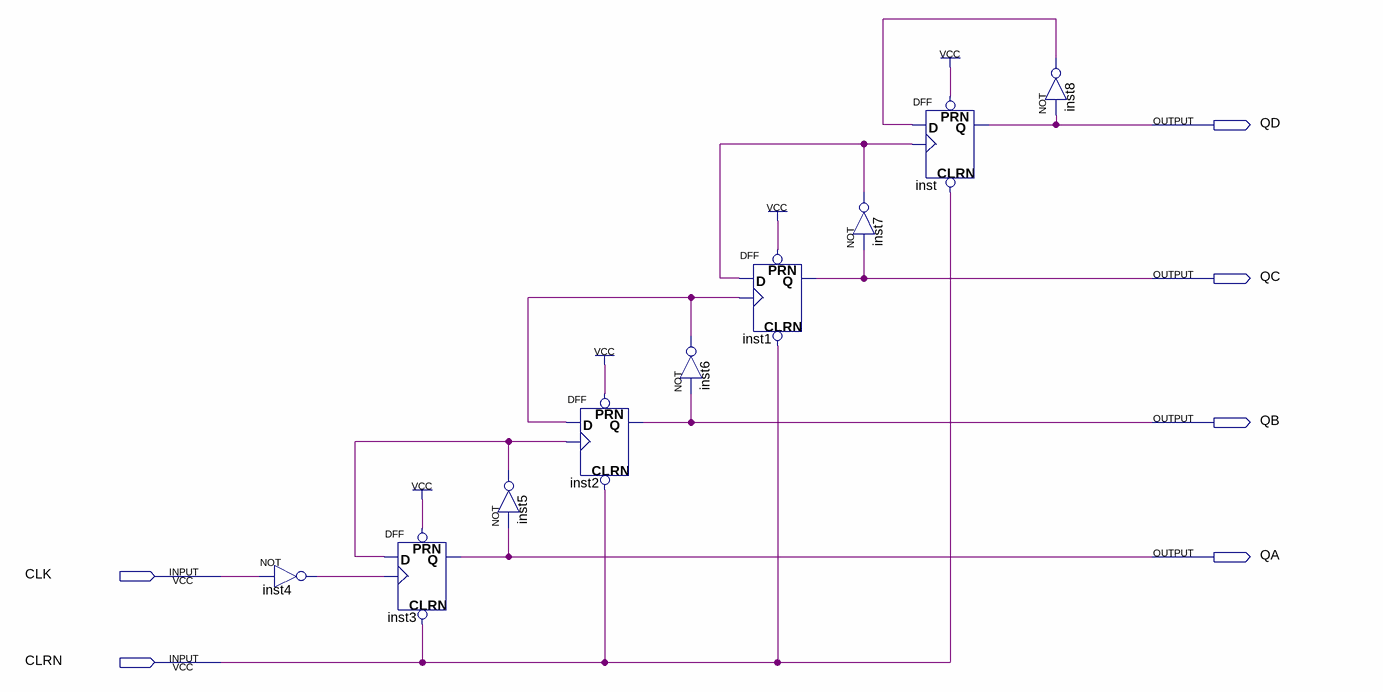
[diagram p0: schematic sheet]
// Quartus schematic FourBitUPCounter.bdf as structural Verilog: 9 symbols, 6 pins
module FourBitUPCounter (
  input  CLK,
  input  CLRN,
  output QD,
  output QC,
  output QB,
  output QA
);

  wire inst4_out, inst5_out, inst6_out, inst7_out, inst8_out;

  not inst4 (inst4_out, CLK);
  DFF inst3 (.CLRN(CLRN), .CLK(inst4_out), .D(inst5_out), .PRN(1'b1), .Q(QA));
  not inst5 (inst5_out, QA);
  DFF inst2 (.CLRN(CLRN), .CLK(inst5_out), .D(inst6_out), .PRN(1'b1), .Q(QB));
  not inst6 (inst6_out, QB);
  DFF inst1 (.CLRN(CLRN), .CLK(inst6_out), .D(inst7_out), .PRN(1'b1), .Q(QC));
  not inst7 (inst7_out, QC);
  DFF inst (.CLRN(CLRN), .CLK(inst7_out), .D(inst8_out), .PRN(1'b1), .Q(QD));
  not inst8 (inst8_out, QD);
endmodule
